# Altium project LPC1768HeaderBoardV1.0.PrjPcb
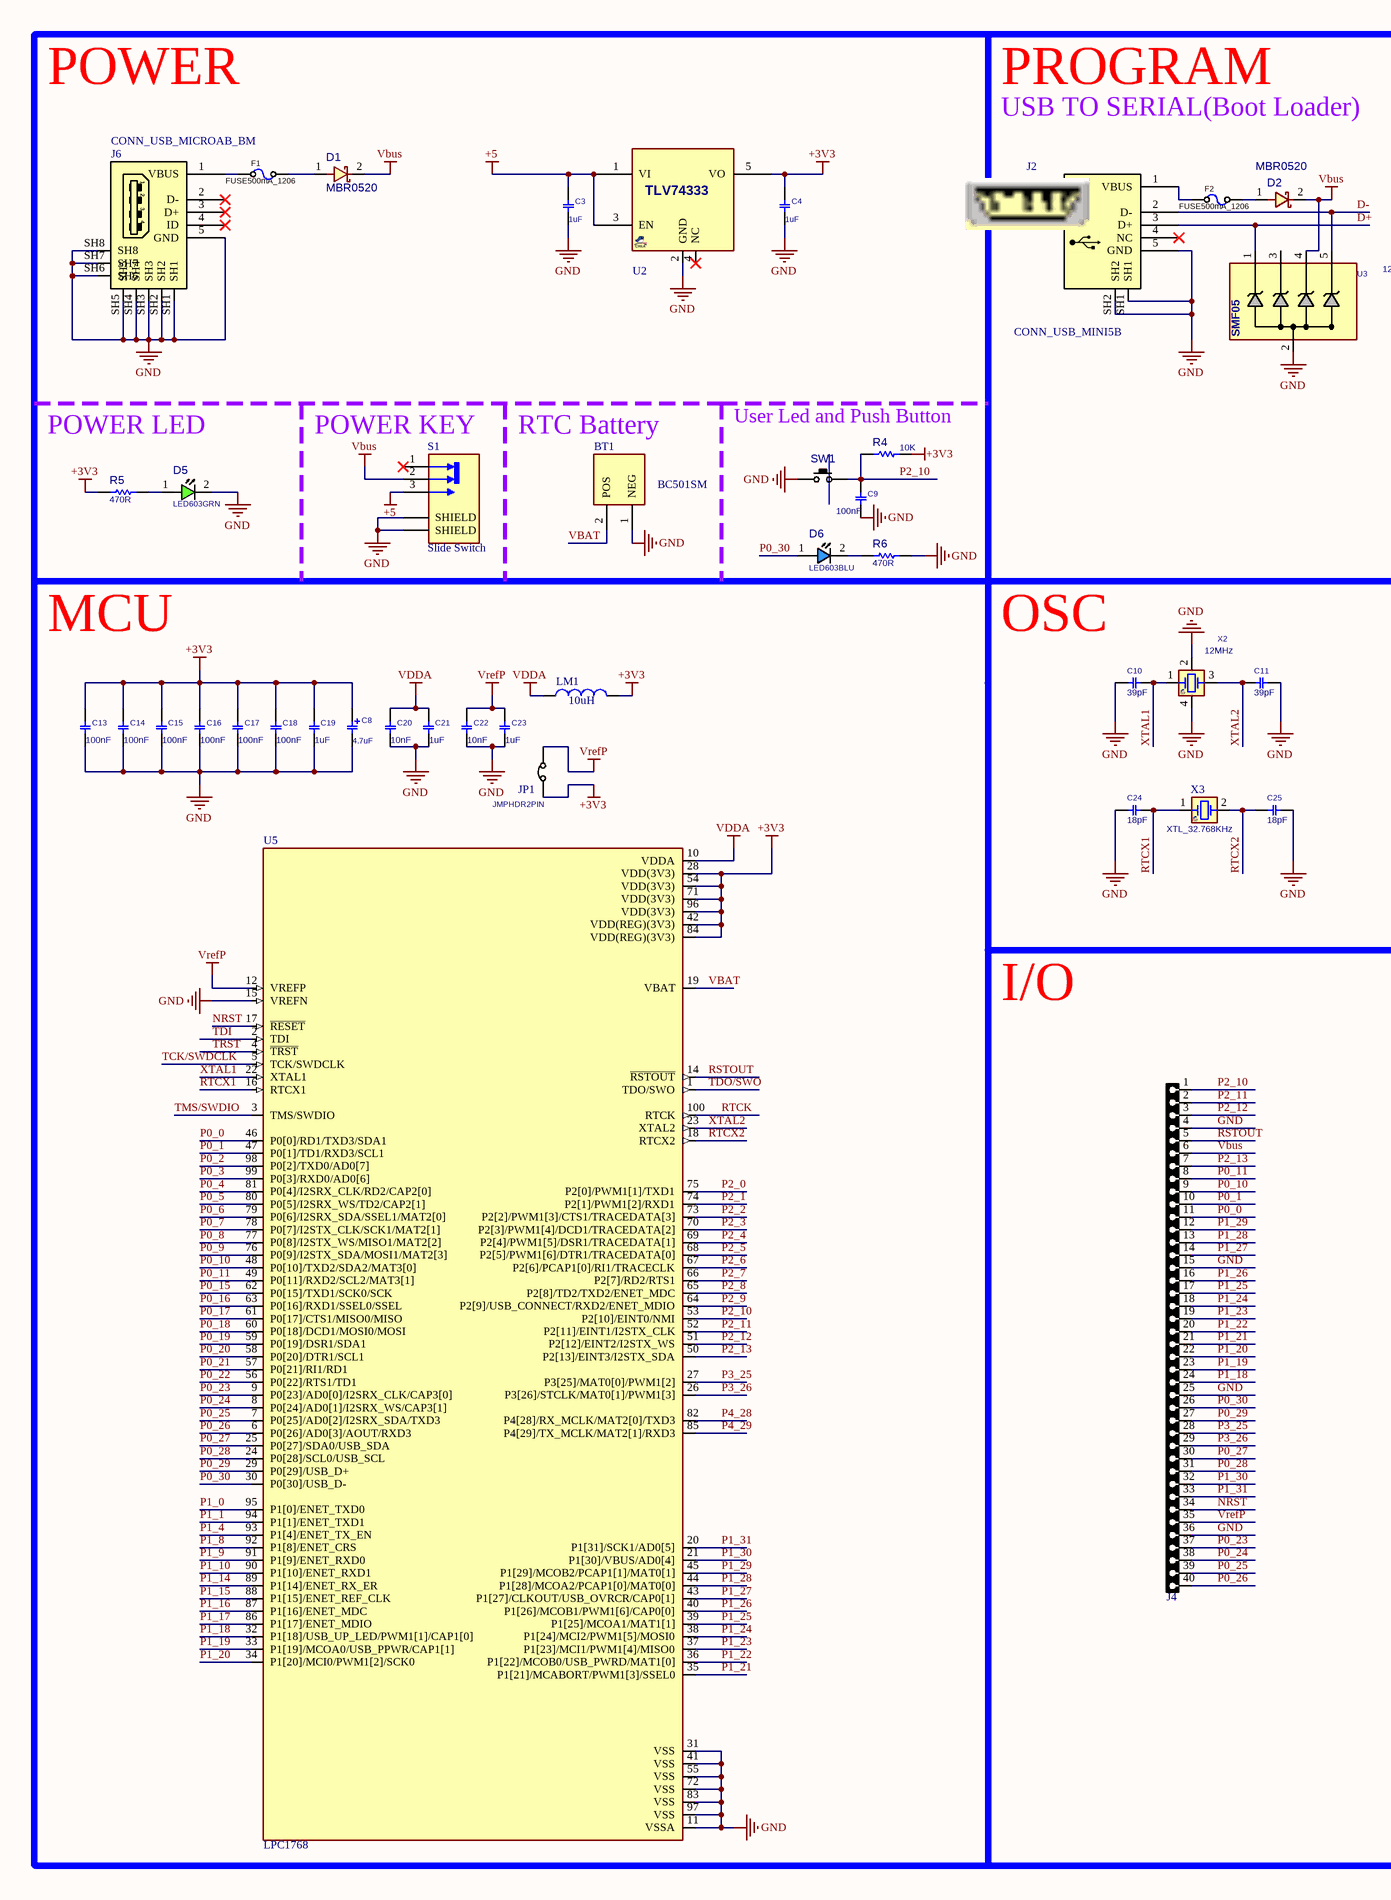
[diagram p0: LPC1768HeaderBoardV1.0Sch.SchDoc, left]
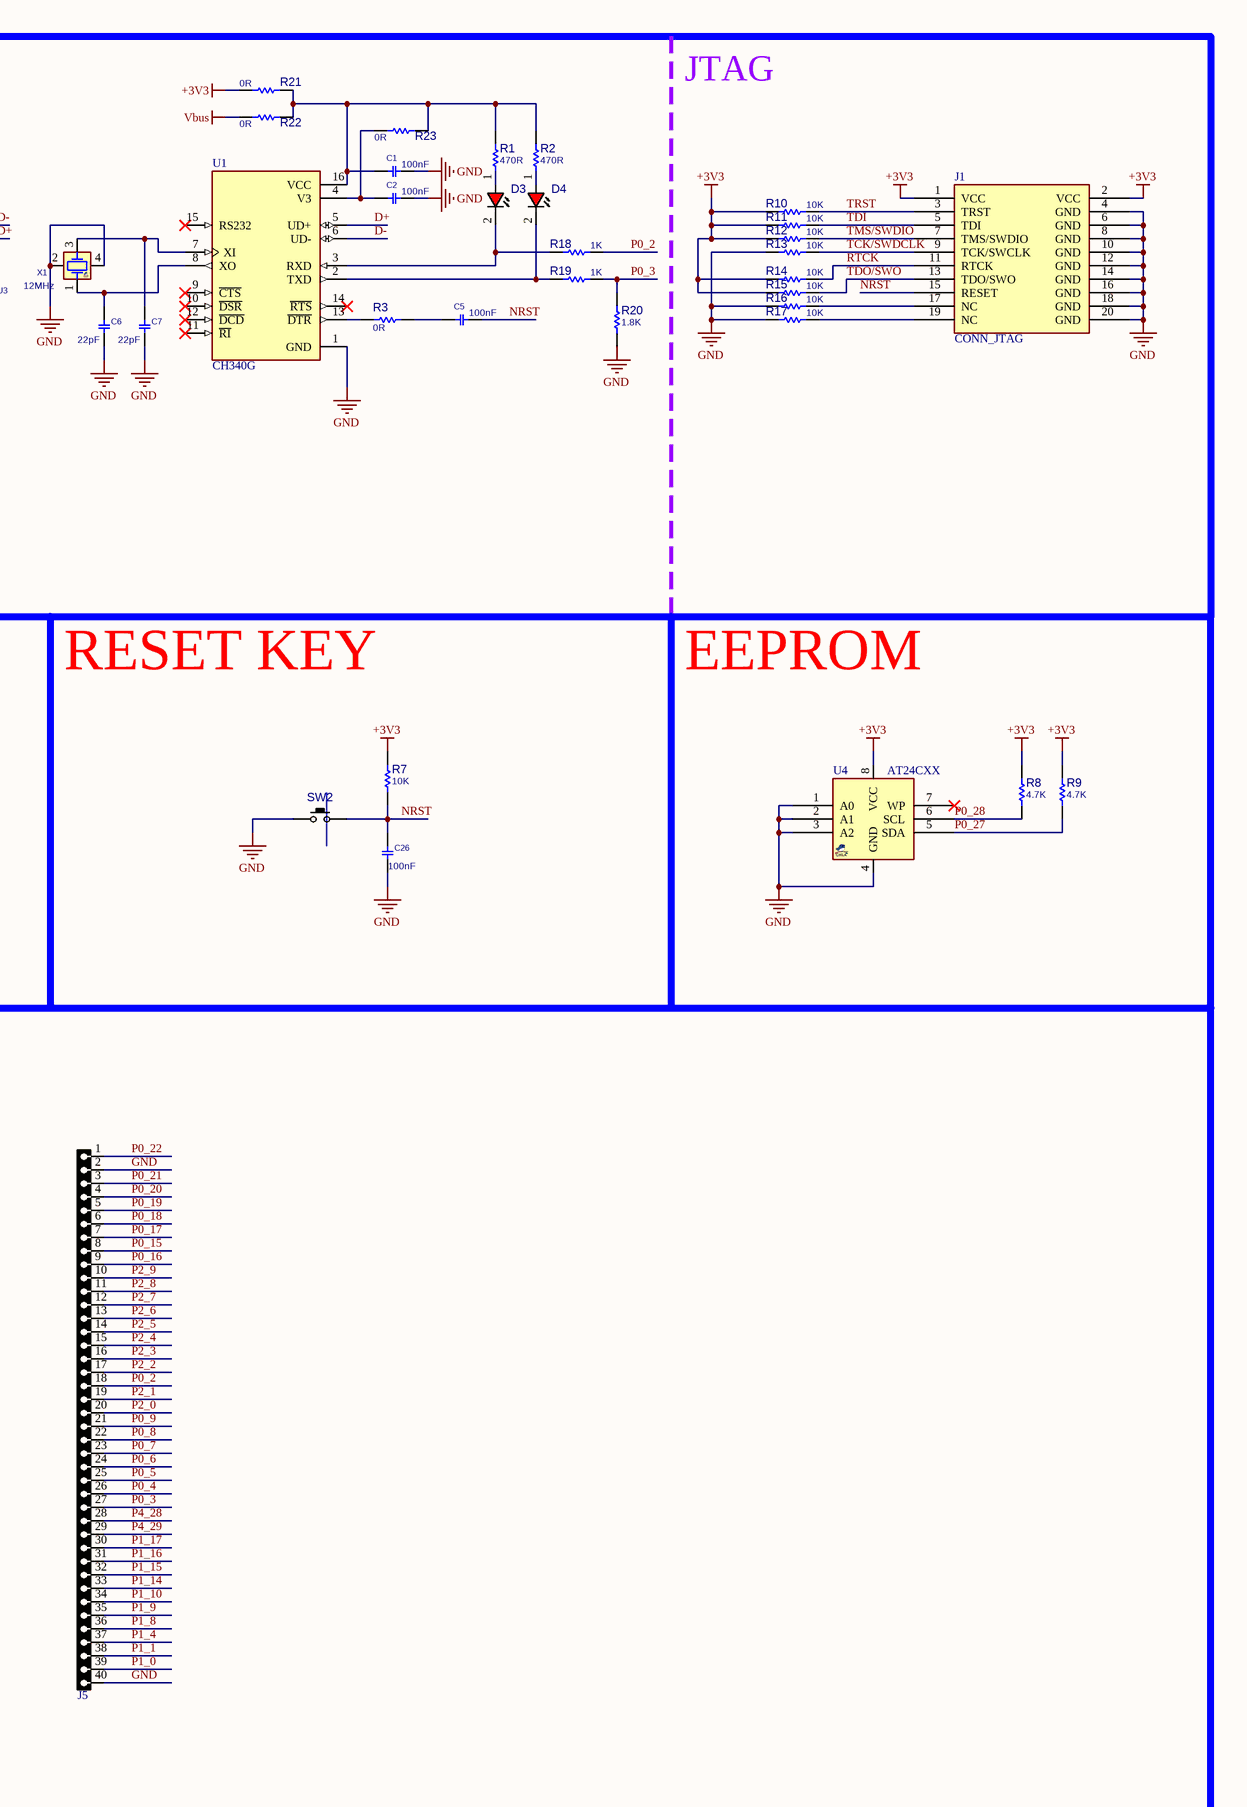
[diagram p1: LPC1768HeaderBoardV1.0Sch.SchDoc, right]
1 sheet, 75 parts. Net scope: global (net labels, ports and power ports of the same name join across sheets).
Board file: LPC1768HeaderBoardV1.0PCB.PcbDoc

## Sheet LPC1768HeaderBoardV1.0Sch.SchDoc
size C; SheetNumber: 1; SheetTotal: 1

### Parts
BT1  BC501SM  [BC501SM]
C1  100nF  [C0603]
C2  100nF  [C0603]
C3  1uF  [C0805]
C4  1uF  [C0805]
C5  100nF  [C0603]
C6  22pF  [C0603]
C7  22pF  [C0603]
C8  4.7uF  [C_TN_3216]
C9  100nF  [C0603]
C10  39pF  [C0603]
C11  39pF  [C0603]
C13  100nF  [C0603]
C14  100nF  [C0603]
C15  100nF  [C0603]
C16  100nF  [C0603]
C17  100nF  [C0603]
C18  100nF  [C0603]
C19  1uF  [C0603]
C20  10nF  [C0603]
C21  1uF  [C0603]
C22  10nF  [C0603]
C23  1uF  [C0603]
C24  18pF  [C0603]
C25  18pF  [C0603]
C26  100nF  [C0603]
D1  MBR0520  [D_SOD123W]
D2  MBR0520  [D_SOD123W]
D3  (no value)  [LED0603RED]
D4  (no value)  [LED0603RED]
D5  LED603GRN  [LED0603GRN]
D6  LED603BLU  [LED0603BLU]
F1  FUSE500mA_1206  [F1206]
F2  FUSE500mA_1206  [F1206]
J1  CONN_JTAG  [IDC_2X10]
J2  CONN_USB_MINI5B  [USB_MINI_B5_SMD]
J4  HDRF40  [HDR_F_1X40]  (value not drawn)
J5  HDRF40  [HDR_F_1X40]  (value not drawn)
J6  CONN_USB_MICROAB_BM  [USB_MICRO_AB_BM_SHT]
JP1  JMPHDR2PIN  [JP_2_BLK]
LM1  10uH  [0805L]
R1  470R  [R0603]
R2  470R  [R0603]
R3  0R  [R0603]
R4  10K  [R0603]
R5  470R  [R0603]
R6  470R  [R0603]
R7  10K  [R0603]
R8  4.7K  [R0603]
R9  4.7K  [R0603]
R10  10K  [R0603]
R11  10K  [R0603]
R12  10K  [R0603]
R13  10K  [R0603]
R14  10K  [R0603]
R15  10K  [R0603]
R16  10K  [R0603]
R17  10K  [R0603]
R18  1K  [R0603]
R19  1K  [R0603]
R20  1.8K  [R0603]
R21  0R  [R0603]
R22  0R  [R0603]
R23  0R  [R0603]
S1  Slide Switch  [Slide Switch]
SW1  PUSHBUTTON  [SWPBS_SPST_6X3X5]  (value not drawn)
SW2  PUSHBUTTON  [SWPBS_SPST_6X3X5]  (value not drawn)
U1  CH340G  [CH340G]
U2  TLV74333  [SOT23_5]  (value not drawn)
U3  TVS_SMF05  [SOT353_5]  (value not drawn)
U4  AT24CXX  [SO_8]
U5  LPC1768  [LPC1768FBD100]
X1  12MHz  [XTL_4_3225]
X2  12MHz  [XTL_4_3225]
X3  XTL_32.768KHz  [XTL_2_3215]

### Blocks framed on the sheet
MCU: C8 C13-C23 JP1 LM1 U5

### Nets
+3V3: C4.2 C8.1 C13.1 C14.1 C15.1 C16.1 C17.1 C18.1 C19.1 J1.1(VCC) J1.2(VCC) JP1.1 LM1.2 R4.1 R5.2 R7.2 R8.1 R9.1 R10.2 R11.2 R12.2 R14.2 R15.2 R21.2 U2.5(VO) U4.8(VCC) U5.28(VDD(3V3)) U5.42(VDD(REG)(3V3)) U5.54(VDD(3V3)) U5.71(VDD(3V3)) U5.84(VDD(REG)(3V3)) U5.96(VDD(3V3))
+5: C3.2 S1.3 U2.1(VI) U2.3(EN)
GND: BT1.1(NEG) C1.2 C2.2 C3.1 C4.1 C6.2 C7.2 C8.2 C9.2 C10.2 C11.1 C13.2 C14.2 C15.2 C16.2 C17.2 C18.2 C19.2 C20.2 C21.2 C22.2 C23.2 C24.2 C25.1 C26.2 D5.2(CATHODE) J1.4(GND) J1.6(GND) J1.8(GND) J1.10(GND) J1.12(GND) J1.14(GND) J1.16(GND) J1.18(GND) J1.20(GND) J2.5(GND) J2.SH1 J2.SH2 J4.4 J4.15 J4.25 J4.36 J5.2 J5.40 J6.5(GND) J6.SH1 J6.SH2 J6.SH3 J6.SH4 J6.SH5 J6.SH6 J6.SH7 J6.SH8 R6.1 R13.2 R16.2 R17.2 R20.2 S1.S1(SHIELD) S1.S2(SHIELD) SW1.1(P1) SW2.1(P1) U1.1(GND) U2.2(GND) U3.2 U4.1(A0) U4.2(A1) U4.3(A2) U4.4(GND) U5.11(VSSA) U5.15(VREFN) U5.31(VSS) U5.41(VSS) U5.55(VSS) U5.72(VSS) U5.83(VSS) U5.97(VSS) X1.2 X1.4 X2.2 X2.4
Vbus: D1.2 D2.2 J4.6 R22.2 S1.2 U3.4
VDDA: C20.1 C21.1 LM1.1 U5.10(VDDA)
VrefP: C22.1 C23.1 J4.35 JP1.2 U5.12(VREFP)
D+: J2.3(D+) U1.5(UD+) U3.1
D-: J2.2(D-) U1.6(UD-) U3.5
NRST: C5.2 C26.1 J1.15(RESET) J4.34 R7.1 SW2.2(P3) U5.17(~{RESET})
P0_0: J4.11 U5.46(P0[0]/RD1/TXD3/SDA1)
P0_1: J4.10 U5.47(P0[1]/TD1/RXD3/SCL1)
P0_2: J5.18 R18.1 U5.98(P0[2]/TXD0/AD0[7])
P0_3: J5.27 R19.1 R20.1 U5.99(P0[3]/RXD0/AD0[6])
P0_4: J5.26 U5.81(P0[4]/I2SRX_CLK/RD2/CAP2[0])
P0_5: J5.25 U5.80(P0[5]/I2SRX_WS/TD2/CAP2[1])
P0_6: J5.24 U5.79(P0[6]/I2SRX_SDA/SSEL1/MAT2[0])
P0_7: J5.23 U5.78(P0[7]/I2STX_CLK/SCK1/MAT2[1])
P0_8: J5.22 U5.77(P0[8]/I2STX_WS/MISO1/MAT2[2])
P0_9: J5.21 U5.76(P0[9]/I2STX_SDA/MOSI1/MAT2[3])
P0_10: J4.9 U5.48(P0[10]/TXD2/SDA2/MAT3[0])
P0_11: J4.8 U5.49(P0[11]/RXD2/SCL2/MAT3[1])
P0_15: J5.8 U5.62(P0[15]/TXD1/SCK0/SCK)
P0_16: J5.9 U5.63(P0[16]/RXD1/SSEL0/SSEL)
P0_17: J5.7 U5.61(P0[17]/CTS1/MISO0/MISO)
P0_18: J5.6 U5.60(P0[18]/DCD1/MOSI0/MOSI)
P0_19: J5.5 U5.59(P0[19]/DSR1/SDA1)
P0_20: J5.4 U5.58(P0[20]/DTR1/SCL1)
P0_21: J5.3 U5.57(P0[21]/RI1/RD1)
P0_22: J5.1 U5.56(P0[22]/RTS1/TD1)
P0_23: J4.37 U5.9(P0[23]/AD0[0]/I2SRX_CLK/CAP3[0])
P0_24: J4.38 U5.8(P0[24]/AD0[1]/I2SRX_WS/CAP3[1])
P0_25: J4.39 U5.7(P0[25]/AD0[2]/I2SRX_SDA/TXD3)
P0_26: J4.40 U5.6(P0[26]/AD0[3]/AOUT/RXD3)
P0_27: J4.30 R9.2 U4.5(SDA) U5.25(P0[27]/SDA0/USB_SDA)
P0_28: J4.31 R8.2 U4.6(SCL) U5.24(P0[28]/SCL0/USB_SCL)
P0_29: J4.27 U5.29(P0[29]/USB_D+)
P0_30: D6.1(ANODE) J4.26 U5.30(P0[30]/USB_D-)
P1_0: J5.39 U5.95(P1[0]/ENET_TXD0)
P1_1: J5.38 U5.94(P1[1]/ENET_TXD1)
P1_4: J5.37 U5.93(P1[4]/ENET_TX_EN)
P1_8: J5.36 U5.92(P1[8]/ENET_CRS)
P1_9: J5.35 U5.91(P1[9]/ENET_RXD0)
P1_10: J5.34 U5.90(P1[10]/ENET_RXD1)
P1_14: J5.33 U5.89(P1[14]/ENET_RX_ER)
P1_15: J5.32 U5.88(P1[15]/ENET_REF_CLK)
P1_16: J5.31 U5.87(P1[16]/ENET_MDC)
P1_17: J5.30 U5.86(P1[17]/ENET_MDIO)
P1_18: J4.24 U5.32(P1[18]/USB_UP_LED/PWM1[1]/CAP1[0])
P1_19: J4.23 U5.33(P1[19]/MCOA0/USB_PPWR/CAP1[1])
P1_20: J4.22 U5.34(P1[20]/MCI0/PWM1[2]/SCK0)
P1_21: J4.21 U5.35(P1[21]/MCABORT/PWM1[3]/SSEL0)
P1_22: J4.20 U5.36(P1[22]/MCOB0/USB_PWRD/MAT1[0])
P1_23: J4.19 U5.37(P1[23]/MCI1/PWM1[4]/MISO0)
P1_24: J4.18 U5.38(P1[24]/MCI2/PWM1[5]/MOSI0)
P1_25: J4.17 U5.39(P1[25]/MCOA1/MAT1[1])
P1_26: J4.16 U5.40(P1[26]/MCOB1/PWM1[6]/CAP0[0])
P1_27: J4.14 U5.43(P1[27]/CLKOUT/USB_OVRCR/CAP0[1])
P1_28: J4.13 U5.44(P1[28]/MCOA2/PCAP1[0]/MAT0[0])
P1_29: J4.12 U5.45(P1[29]/MCOB2/PCAP1[1]/MAT0[1])
P1_30: J4.32 U5.21(P1[30]/VBUS/AD0[4])
P1_31: J4.33 U5.20(P1[31]/SCK1/AD0[5])
P2_0: J5.20 U5.75(P2[0]/PWM1[1]/TXD1)
P2_1: J5.19 U5.74(P2[1]/PWM1[2]/RXD1)
P2_2: J5.17 U5.73(P2[2]/PWM1[3]/CTS1/TRACEDATA[3])
P2_3: J5.16 U5.70(P2[3]/PWM1[4]/DCD1/TRACEDATA[2])
P2_4: J5.15 U5.69(P2[4]/PWM1[5]/DSR1/TRACEDATA[1])
P2_5: J5.14 U5.68(P2[5]/PWM1[6]/DTR1/TRACEDATA[0])
P2_6: J5.13 U5.67(P2[6]/PCAP1[0]/RI1/TRACECLK)
P2_7: J5.12 U5.66(P2[7]/RD2/RTS1)
P2_8: J5.11 U5.65(P2[8]/TD2/TXD2/ENET_MDC)
P2_9: J5.10 U5.64(P2[9]/USB_CONNECT/RXD2/ENET_MDIO)
P2_10: C9.1 J4.1 R4.2 SW1.2(P3) U5.53(P2[10]/EINT0/NMI)
P2_11: J4.2 U5.52(P2[11]/EINT1/I2STX_CLK)
P2_12: J4.3 U5.51(P2[12]/EINT2/I2STX_WS)
P2_13: J4.7 U5.50(P2[13]/EINT3/I2STX_SDA)
P3_25: J4.28 U5.27(P3[25]/MAT0[0]/PWM1[2])
P3_26: J4.29 U5.26(P3[26]/STCLK/MAT0[1]/PWM1[3])
P4_28: J5.28 U5.82(P4[28]/RX_MCLK/MAT2[0]/TXD3)
P4_29: J5.29 U5.85(P4[29]/TX_MCLK/MAT2[1]/RXD3)
RSTOUT: J4.5 U5.14(~{RSTOUT})
RTCK: J1.11(RTCK) R14.1 U5.100(RTCK)
RTCX1: C24.1 U5.16(RTCX1) X3.1(OSC1)
RTCX2: C25.2 U5.18(RTCX2) X3.2(OSC2)
TCK/SWDCLK: J1.9(TCK/SWCLK) R13.1 U5.5(TCK/SWDCLK)
TDI: J1.5(TDI) R11.1 U5.2(TDI)
TDO/SWO: J1.13(TDO/SWO) R15.1 U5.1(TDO/SWO)
TMS/SWDIO: J1.7(TMS/SWDIO) R12.1 U5.3(TMS/SWDIO)
TRST: J1.3(TRST) R10.1 U5.4(~{TRST})
VBAT: BT1.2(POS) U5.19(VBAT)
XTAL1: C10.1 U5.22(XTAL1) X2.1
XTAL2: C11.2 U5.23(XTAL2) X2.3
NetC1_1: C1.1 R1.1 R2.1 R21.1 R22.1 R23.1 U1.16(VCC)
NetC2_1: C2.1 R23.2 U1.4(V3)
NetC5_1: C5.1 R3.1
NetC6_1: C6.1 U1.8(XO) X1.1
NetC7_1: C7.1 U1.7(XI) X1.3
NetD1_1: D1.1 F1.2
NetD2_1: D2.1 F2.2
NetD3_1: D3.1(ANODE) R1.2
NetD3_2: D3.2(CATHODE) R18.2 U1.3(RXD)
NetD4_1: D4.1(ANODE) R2.2
NetD4_2: D4.2(CATHODE) R19.2 U1.2(TXD)
NetD5_1: D5.1(ANODE) R5.1
NetD6_2: D6.2(CATHODE) R6.2
NetF1_1: F1.1 J6.1(VBUS)
NetF2_1: F2.1 J2.1(VBUS)
NetJ1_17: J1.17(NC) R16.1
NetJ1_19: J1.19(NC) R17.1
NetR3_2: R3.2 U1.13(~{DTR})

Not connected (* = marked no-connect by the designer): J2 4(NC)*; J6 2(D-)* 3(D+)* 4(ID)*; S1 1*; U1 9(~{CTS})* 10(~{DSR})* 11(~{RI})* 12(~{DCD})* 14(~{RTS})* 15(RS232)*; U2 4(NC)*; U3 3; U4 7(WP)*

### Notes on the sheet
- JTAG
- POWER
- PROGRAM
- USB TO SERIAL(Boot Loader)
- POWER LED
- (near S1) POWER KEY
- RTC Battery
- (near R4) User Led and Push Button
- OSC
- RESET KEY
- EEPROM
- I/O

### Library data of the parts
C1 C2 C5-C7 C9-C11 C13-C26 = CAP_SMD_MLCC_0603: CAP, MLCC; PARAM: -, -%; MANF_P#: MANF_PART#; PARAM2: -V; VALUE: -F; PRICE: 100= 1$; MANF: -; ASSEMBLY: ASSEMBLY
C3 C4 = CAP_SMD_MLCC_0805: CAP, MLCC, -F, -V, MATERIAL, -%, 0201; PARAM: -, -%; MANF_P#: MANF_PART#; PRICE: 100= 1$; MANF: -; PARAM2: -V; ASSEMBLY: ASSEMBLY
C8 = CAP_SMD_TAN_3216: CAP, SMD, TAN,; PARAM2: -V; VALUE: 4.7uF
D1 D2 = DIODE_SMD_SCHOTTKY_MBR0520: DIODE, SCHOTTKY, 20V, 0.5A; MANF: ON; MANF_P#: MBR0520LT1G; DESC: DESCRIPTION; ASSEMBLY: ASSEMBLY; PRICE: PRICE; PARAM2: 0.5A; PARAM: 20V; VALUE: MBR0520
D3 D4 = LED_SMD_0603_RED: LED, SMD, 0603, RED; PARAM: 30mA, 640nm; DESC: DESCRIPTION; MANF_P#: MANF_PART#; PARAM2: 1.8~2.5V; MANF: MANF; ASSEMBLY: ASSEMBLY; PRICE: PRICE
D5 = LED_SMD_0603_GRN: LED, SMD, 0603, GREEN; PARAM: 20mA; MANF: Kingbright; DESC: DESCRIPTION; MANF_P#: APT1608SGC; PARAM2: 2.2V; ASSEMBLY: ASSEMBLY; PRICE: 1: 0.14$, 100: 6.8$; VALUE: LED603GRN
D6 = LED_SMD_0603_BLU: LED, SMD, 0603, BLUE; PARAM: 30mA, 470nm, 120° Angle; DESC: DESCRIPTION; MANF_P#: MANF_PART#; PARAM2: 2.2~3V; MANF: MANF; ASSEMBLY: ASSEMBLY; PRICE: PRICE; VALUE: LED603BLU
F1 F2 = FUSE_3A_1206_SLOW: Fuse, 3A, 32VDC, 1206, SMD, Slow Blow; PARAM: 3A; 32VDC; Slow Blow; MANF: Bourns; MANF_P#: SF-1206SP300-2; PARAM2: 0.027Ohm; PRICE: 0.9$; VALUE: FUSE500mA_1206
J1 = CONN_JTAG_ARM_20: CONN, JTAG, ARM, 20P; VALUE: CONN_JTAG
J2 = CONN_USB_MINI5B_SMD: CONN, USB, MINI 5 B, R/A, SMD; MANF_P#: UX60-MB-5ST; MANF: Hirose; MANF_P#2: 67503-1020 MOLEX; VALUE: CONN_USB_MINI5B
J4 J5 = HDR_F_1X40: CONN, HEADER, Female, pitch: 2.54mm, 40POS; VALUE: HDRF40
J6 = CONN_USB_MICRO_AB_BM_SHT: CONN, USB, MICRO AB, R/A, SMD, BOTTOM MOUNT; MANF_P#: 47589-0001; MANF: MOLEX; PARAM2: 30VAC; PARAM: 1.8A, -20~85oC; MANF_P#2: HIROSE ZX62D-AB-5P8; PRICE: 0.75$; VALUE: CONN_USB_MICROAB_BM
JP1 = JUMPER_HDR_2P: JUMPER, HEADER 2PIN; MANF: MANF; MANF_P#: MANF_P#; VALUE: JMPHDR2PIN
LM1 = L SMA 0.25W: Inductor; Code_IEC: 1005; Value: FB805; Published: 8-Jun-2000; LatestRevisionDate: 29-May-2009; LatestRevisionNote: IPC-7351 Footprint Added.; PackageReference: 0402-A; Publisher: Altium Limited; PackageDescription: Chip Inductor; Code_JEITA: 0402
R1-R23 = RES_SMD_0603: RESISTOR, SMD; PARAM: 1%, 0.1W; DESC: DESCRIPTION; DIST#: MOUSER; MANF_P#: -; MANF: -; ASSEMBLY: ASSEMBLY; PRICE: -; PARAM2: -
S1 = Slide Switch: Push Slide Switch
SW1 SW2 = SWPBS_SPST_6X3_222BMVBAR: SWITCH, PUSH BUTTON, TACTILE, SMD, SPST, 6X3.5X5mm; MANF: CTS; DESC: DESCRIPTION; VALUE: PUSHBUTTON; ASSEMBLY: ASSEMBLY; PARAM: PARAM; PRICE: PRICE; MANF_P#: 222BMVBAR
U1 = CH340G: USB Interface Integrated Circuit
U2 = VREG_TLV74333_SOT23: REG, Linear, LDO0.12V, Fixed, 300mA, VIN1.4~5.5V, VOUT1~5.5V, SOT-23-5; MANF: Texas Instruments; MANF_P#: TLV74333PDQN; PARAM2: 1.4~5.5Vin, LDO0.12V, Fixed3.0V; PARAM: 300mA, 50dB PSRR, -40~125°C; PRICE: $0.3; VALUE: TLV74333
U3 = TVS_X4_SMF05: TVS, ESD PROTECT, 4CH, 5VRWM, 15KV; MANF_P#: SMF05; MANF: Semtech; PARAM: 5VRWM, 15KV; VALUE: TVS_SMF05
U4 = EEPROM_I2C_AT24CXX_SOP8: EEPROM, I2C,; Value: AT24CXX
U5 = LPC1768FBD100: ARM Cortex-M3 512KB Flash , 64KB SRAM LQFP-100 , 100MHZ
X1 X2 = XTL_4_12MHz_3225: Crystal 12MHz; MANF: ECS; MANF_P#: ECS-120-18-33-JEM-TR; PARAM: 20PPM, 18pF; PRICE: 0.5$; VALUE: 12MHz
X3 = XTL_2_32.768_3215A: Crystal, 32.768KHz, 3pF, 20PPM; MANF: ABRACON; MANF_P#: ABS07W-32.768kHz-D-2-T; PARAM: -40~85oC; PARAM2: 3pF, 20PPM; PRICE: 1$; VALUE: XTL_32.768KHz